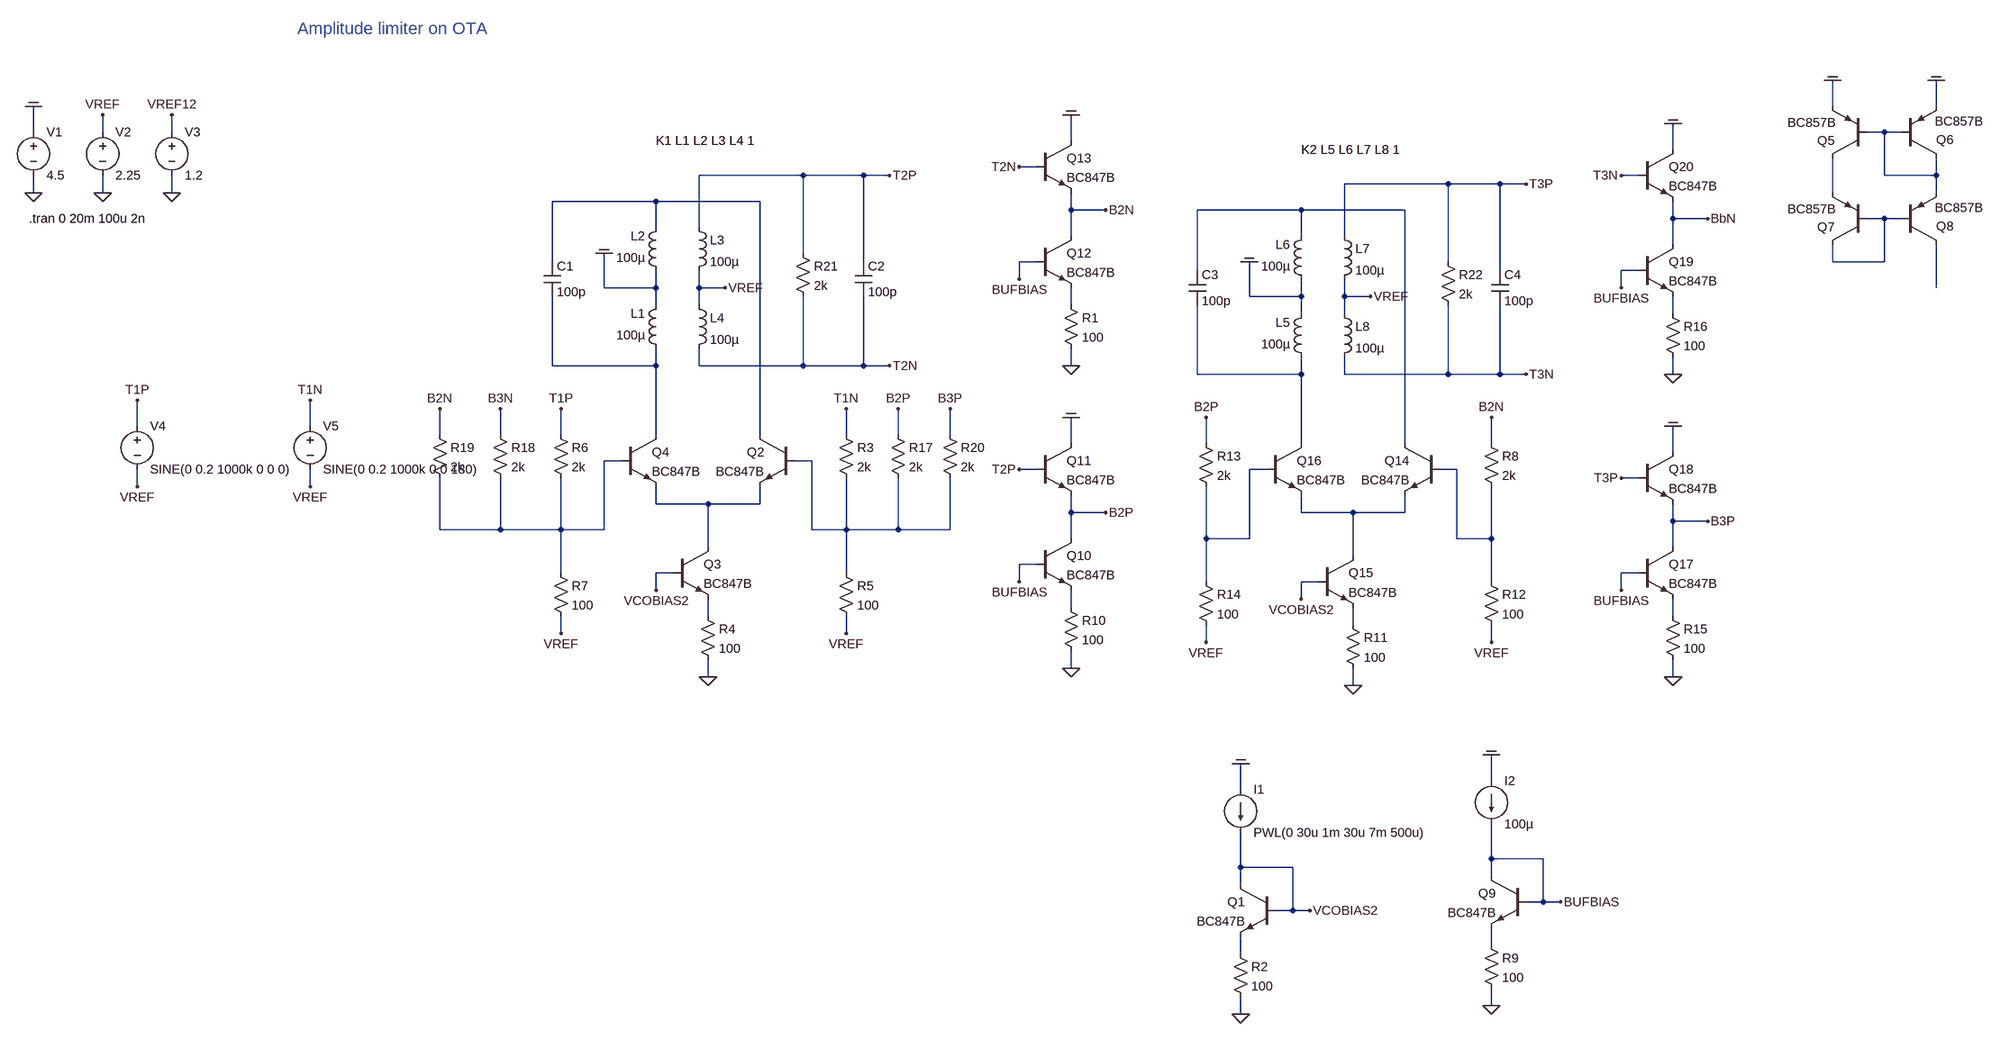
[diagram p0: schematic vco_bjt_v01.asc]
vco_bjt_v01.asc, the LTspice schematic file:
Version 4.1
SHEET 1 4092 1300
WIRE 3808 -464 3808 -512
WIRE 4000 -464 4000 -512
WIRE -1136 -416 -1136 -464
WIRE -1008 -416 -1008 -448
WIRE -880 -416 -880 -448
WIRE 3904 -416 3872 -416
WIRE 3936 -416 3904 -416
WIRE 784 -400 784 -448
WIRE 2016 -384 2016 -432
WIRE 720 -352 688 -352
WIRE 288 -336 96 -336
WIRE 400 -336 288 -336
WIRE 448 -336 400 -336
WIRE 1952 -336 1920 -336
WIRE 3904 -336 3904 -416
WIRE 4000 -336 4000 -368
WIRE 4000 -336 3904 -336
WIRE 1600 -320 1408 -320
WIRE 1696 -320 1600 -320
WIRE 1744 -320 1696 -320
WIRE -1136 -304 -1136 -336
WIRE -1008 -304 -1008 -336
WIRE -880 -304 -880 -336
WIRE 3808 -304 3808 -368
WIRE 4000 -304 4000 -336
WIRE 16 -288 -176 -288
WIRE 208 -288 16 -288
WIRE 784 -272 784 -304
WIRE 848 -272 784 -272
WIRE 1328 -272 1136 -272
WIRE 1520 -272 1328 -272
WIRE 2016 -256 2016 -288
WIRE 2080 -256 2016 -256
WIRE 3904 -256 3872 -256
WIRE 3936 -256 3904 -256
WIRE 16 -240 16 -288
WIRE 96 -240 96 -336
WIRE 784 -224 784 -272
WIRE 1328 -224 1328 -272
WIRE 1408 -224 1408 -320
WIRE 2016 -208 2016 -256
WIRE 288 -192 288 -336
WIRE -176 -176 -176 -288
WIRE 400 -176 400 -336
WIRE 720 -176 688 -176
WIRE 1600 -176 1600 -320
WIRE 3808 -176 3808 -208
WIRE 3904 -176 3904 -256
WIRE 3904 -176 3808 -176
WIRE 1136 -160 1136 -272
WIRE 1696 -160 1696 -320
WIRE 1952 -160 1920 -160
WIRE 688 -144 688 -176
WIRE -80 -128 -80 -192
WIRE 16 -128 16 -160
WIRE 16 -128 -80 -128
WIRE 96 -128 96 -160
WIRE 144 -128 96 -128
WIRE 1920 -128 1920 -160
WIRE 4000 -128 4000 -208
WIRE 1232 -112 1232 -176
WIRE 1328 -112 1328 -144
WIRE 1328 -112 1232 -112
WIRE 1408 -112 1408 -144
WIRE 1456 -112 1408 -112
WIRE 16 -96 16 -128
WIRE 96 -96 96 -128
WIRE 784 -96 784 -128
WIRE 1328 -80 1328 -112
WIRE 1408 -80 1408 -112
WIRE 2016 -80 2016 -112
WIRE -176 16 -176 -112
WIRE 16 16 16 -16
WIRE 16 16 -176 16
WIRE 96 16 96 -16
WIRE 288 16 288 -112
WIRE 288 16 96 16
WIRE 400 16 400 -112
WIRE 400 16 288 16
WIRE 448 16 400 16
WIRE 784 16 784 -16
WIRE 1136 32 1136 -96
WIRE 1328 32 1328 0
WIRE 1328 32 1136 32
WIRE 1408 32 1408 0
WIRE 1600 32 1600 -96
WIRE 1600 32 1408 32
WIRE 1696 32 1696 -96
WIRE 1696 32 1600 32
WIRE 1744 32 1696 32
WIRE 2016 32 2016 0
WIRE -944 128 -944 80
WIRE -624 128 -624 80
WIRE -384 144 -384 96
WIRE -272 144 -272 96
WIRE -160 144 -160 96
WIRE 16 144 16 16
WIRE 208 144 208 -288
WIRE 368 144 368 96
WIRE 464 144 464 96
WIRE 560 144 560 96
WIRE 784 160 784 112
WIRE 1152 160 1152 112
WIRE 1328 160 1328 32
WIRE 1520 160 1520 -272
WIRE 1680 160 1680 112
WIRE 2016 176 2016 128
WIRE -48 192 -80 192
WIRE 304 192 272 192
WIRE 720 208 688 208
WIRE 1264 208 1232 208
WIRE 1616 208 1584 208
WIRE 1952 224 1920 224
WIRE -944 240 -944 208
WIRE -624 240 -624 208
WIRE 16 272 16 240
WIRE 112 272 16 272
WIRE 208 272 208 240
WIRE 208 272 112 272
WIRE 784 288 784 256
WIRE 848 288 784 288
WIRE 1328 288 1328 256
WIRE 1424 288 1328 288
WIRE 1520 288 1520 256
WIRE 1520 288 1424 288
WIRE 2016 304 2016 272
WIRE 2080 304 2016 304
WIRE -384 320 -384 224
WIRE -272 320 -272 224
WIRE -272 320 -384 320
WIRE -160 320 -160 224
WIRE -160 320 -272 320
WIRE -80 320 -80 192
WIRE -80 320 -160 320
WIRE 304 320 304 192
WIRE 368 320 368 224
WIRE 368 320 304 320
WIRE 464 320 464 224
WIRE 464 320 368 320
WIRE 560 320 560 224
WIRE 560 320 464 320
WIRE 784 336 784 288
WIRE 1152 336 1152 240
WIRE 1232 336 1232 208
WIRE 1232 336 1152 336
WIRE 1616 336 1616 208
WIRE 1680 336 1680 240
WIRE 1680 336 1616 336
WIRE 112 352 112 272
WIRE 2016 352 2016 304
WIRE 1424 368 1424 288
WIRE 720 384 688 384
WIRE -160 400 -160 320
WIRE 48 400 16 400
WIRE 368 400 368 320
WIRE 1952 400 1920 400
WIRE 688 416 688 384
WIRE 1152 416 1152 336
WIRE 1360 416 1328 416
WIRE 1680 416 1680 336
WIRE 16 432 16 400
WIRE 1920 432 1920 400
WIRE 1328 448 1328 416
WIRE 784 464 784 432
WIRE 112 480 112 448
WIRE 2016 480 2016 448
WIRE 1424 496 1424 464
WIRE -160 512 -160 480
WIRE 368 512 368 480
WIRE 1152 528 1152 496
WIRE 1680 528 1680 496
WIRE 784 576 784 544
WIRE 112 592 112 560
WIRE 2016 592 2016 560
WIRE 1424 608 1424 576
WIRE 1680 848 1680 800
WIRE 1216 864 1216 816
WIRE 1680 992 1680 928
WIRE 1776 992 1680 992
WIRE 1216 1008 1216 944
WIRE 1312 1008 1216 1008
WIRE 1680 1024 1680 992
WIRE 1216 1040 1216 1008
WIRE 1776 1072 1776 992
WIRE 1776 1072 1744 1072
WIRE 1808 1072 1776 1072
WIRE 1312 1088 1312 1008
WIRE 1312 1088 1280 1088
WIRE 1344 1088 1312 1088
WIRE 1680 1152 1680 1120
WIRE 1216 1168 1216 1136
WIRE 1680 1264 1680 1232
WIRE 1216 1280 1216 1248
FLAG 1344 1088 VCOBIAS2
FLAG 1216 1280 0
FLAG 16 432 VCOBIAS2
FLAG 368 512 VREF
FLAG 112 592 0
FLAG 3808 -512 COM
FLAG 4000 -512 COM
FLAG -1136 -304 0
FLAG -1136 -464 COM
FLAG -1008 -304 0
FLAG -1008 -448 VREF
FLAG -880 -304 0
FLAG -880 -448 VREF12
FLAG -80 -192 COM
FLAG 144 -128 VREF
FLAG 368 96 T1N
FLAG -160 512 VREF
FLAG -160 96 T1P
FLAG -944 240 VREF
FLAG -944 80 T1P
FLAG -624 240 VREF
FLAG -624 80 T1N
FLAG 448 -336 T2P
FLAG 448 16 T2N
FLAG 1216 816 COM
FLAG 1808 1072 BUFBIAS
FLAG 1680 1264 0
FLAG 1680 800 COM
FLAG 688 416 BUFBIAS
FLAG 784 576 0
FLAG 784 112 COM
FLAG 688 208 T2P
FLAG 688 -144 BUFBIAS
FLAG 784 16 0
FLAG 784 -448 COM
FLAG 688 -352 T2N
FLAG 848 288 B2P
FLAG 848 -272 B2N
FLAG 1328 448 VCOBIAS2
FLAG 1680 528 VREF
FLAG 1424 608 0
FLAG 1232 -176 COM
FLAG 1456 -112 VREF
FLAG 1680 112 B2N
FLAG 1152 528 VREF
FLAG 1152 112 B2P
FLAG 1744 -320 T3P
FLAG 1744 32 T3N
FLAG 1920 432 BUFBIAS
FLAG 2016 592 0
FLAG 2016 128 COM
FLAG 1920 224 T3P
FLAG 1920 -128 BUFBIAS
FLAG 2016 32 0
FLAG 2016 -432 COM
FLAG 1920 -336 T3N
FLAG 2080 304 B3P
FLAG 2080 -256 BbN
FLAG 464 96 B2P
FLAG -272 96 B3N
FLAG -384 96 B2N
FLAG 560 96 B3P
SYMBOL npn 1280 1040 M0
SYMATTR InstName Q1
SYMATTR Value BC847B
SYMBOL Res 1200 1152 R0
SYMATTR InstName R2
SYMATTR Value 100
SYMBOL npn 272 144 M0
SYMATTR InstName Q2
SYMATTR Value BC847B
SYMBOL npn 48 352 R0
SYMATTR InstName Q3
SYMATTR Value BC847B
SYMBOL npn -48 144 R0
SYMATTR InstName Q4
SYMATTR Value BC847B
SYMBOL Res 352 128 R0
SYMATTR InstName R3
SYMATTR Value 2k
SYMBOL Res 96 464 R0
SYMATTR InstName R4
SYMATTR Value 100
SYMBOL Res 352 384 R0
SYMATTR InstName R5
SYMATTR Value 100
SYMBOL pnp 3872 -368 R180
WINDOW 0 60 32 Left 2
WINDOW 3 58 66 Left 2
SYMATTR InstName Q5
SYMATTR Value BC857B
SYMBOL pnp 3936 -368 M180
WINDOW 0 64 34 Left 2
WINDOW 3 61 68 Left 2
SYMATTR InstName Q6
SYMATTR Value BC857B
SYMBOL pnp 3872 -208 R180
WINDOW 0 60 32 Left 2
WINDOW 3 58 66 Left 2
SYMATTR InstName Q7
SYMATTR Value BC857B
SYMBOL pnp 3936 -208 M180
WINDOW 0 64 34 Left 2
WINDOW 3 61 68 Left 2
SYMATTR InstName Q8
SYMATTR Value BC857B
SYMBOL voltage -1136 -432 R0
SYMATTR InstName V1
SYMATTR Value 4.5
SYMBOL Voltage -1008 -432 R0
SYMATTR InstName V2
SYMATTR Value 2.25
SYMBOL Voltage -880 -432 R0
SYMATTR InstName V3
SYMATTR Value 1.2
SYMBOL ind 32 0 R180
WINDOW 0 36 80 Left 2
WINDOW 3 36 40 Left 2
SYMATTR InstName L1
SYMATTR Value 100µ
SYMATTR Type ind
SYMATTR SpiceLine Rser=10m Cpar=3p
SYMBOL ind 32 -144 R180
WINDOW 0 36 80 Left 2
WINDOW 3 36 40 Left 2
SYMATTR InstName L2
SYMATTR Value 100µ
SYMATTR Type ind
SYMATTR SpiceLine Rser=10m Cpar=3p
SYMBOL ind 80 -256 R0
SYMATTR InstName L3
SYMATTR Value 100µ
SYMATTR Type ind
SYMATTR SpiceLine Rser=10m Cpar=3p
SYMBOL ind 80 -112 R0
SYMATTR InstName L4
SYMATTR Value 100µ
SYMATTR Type ind
SYMATTR SpiceLine Rser=10m Cpar=3p
SYMBOL cap -192 -176 R0
SYMATTR InstName C1
SYMATTR Value 100p
SYMBOL cap 384 -176 R0
SYMATTR InstName C2
SYMATTR Value 100p
SYMBOL Res -176 128 R0
SYMATTR InstName R6
SYMATTR Value 2k
SYMBOL Res -176 384 R0
SYMATTR InstName R7
SYMATTR Value 100
SYMBOL voltage -944 112 R0
WINDOW 123 0 0 Left 0
WINDOW 39 0 0 Left 0
SYMATTR InstName V4
SYMATTR Value SINE(0 0.2 1000k 0 0 0)
SYMBOL voltage -624 112 R0
WINDOW 123 0 0 Left 0
WINDOW 39 0 0 Left 0
SYMATTR InstName V5
SYMATTR Value SINE(0 0.2 1000k 0 0 180)
SYMBOL current 1216 864 R0
WINDOW 123 0 0 Left 0
WINDOW 39 0 0 Left 0
SYMATTR InstName I1
SYMATTR Value PWL(0 30u 1m 30u 7m 500u)
SYMBOL npn 1744 1024 M0
SYMATTR InstName Q9
SYMATTR Value BC847B
SYMBOL Res 1664 1136 R0
SYMATTR InstName R9
SYMATTR Value 100
SYMBOL current 1680 848 R0
WINDOW 123 0 0 Left 0
WINDOW 39 0 0 Left 0
SYMATTR InstName I2
SYMATTR Value 100µ
SYMBOL npn 720 336 R0
SYMATTR InstName Q10
SYMATTR Value BC847B
SYMBOL Res 768 448 R0
SYMATTR InstName R10
SYMATTR Value 100
SYMBOL npn 720 160 R0
SYMATTR InstName Q11
SYMATTR Value BC847B
SYMBOL npn 720 -224 R0
SYMATTR InstName Q12
SYMATTR Value BC847B
SYMBOL Res 768 -112 R0
SYMATTR InstName R1
SYMATTR Value 100
SYMBOL npn 720 -400 R0
SYMATTR InstName Q13
SYMATTR Value BC847B
SYMBOL npn 1584 160 M0
SYMATTR InstName Q14
SYMATTR Value BC847B
SYMBOL npn 1360 368 R0
SYMATTR InstName Q15
SYMATTR Value BC847B
SYMBOL npn 1264 160 R0
SYMATTR InstName Q16
SYMATTR Value BC847B
SYMBOL Res 1664 144 R0
SYMATTR InstName R8
SYMATTR Value 2k
SYMBOL Res 1408 480 R0
SYMATTR InstName R11
SYMATTR Value 100
SYMBOL Res 1664 400 R0
SYMATTR InstName R12
SYMATTR Value 100
SYMBOL ind 1344 16 R180
WINDOW 0 36 80 Left 2
WINDOW 3 36 40 Left 2
SYMATTR InstName L5
SYMATTR Value 100µ
SYMATTR Type ind
SYMATTR SpiceLine Rser=10m Cpar=3p
SYMBOL ind 1344 -128 R180
WINDOW 0 36 80 Left 2
WINDOW 3 36 40 Left 2
SYMATTR InstName L6
SYMATTR Value 100µ
SYMATTR Type ind
SYMATTR SpiceLine Rser=10m Cpar=3p
SYMBOL ind 1392 -240 R0
SYMATTR InstName L7
SYMATTR Value 100µ
SYMATTR Type ind
SYMATTR SpiceLine Rser=10m Cpar=3p
SYMBOL ind 1392 -96 R0
SYMATTR InstName L8
SYMATTR Value 100µ
SYMATTR Type ind
SYMATTR SpiceLine Rser=10m Cpar=3p
SYMBOL cap 1120 -160 R0
SYMATTR InstName C3
SYMATTR Value 100p
SYMBOL cap 1680 -160 R0
SYMATTR InstName C4
SYMATTR Value 100p
SYMBOL Res 1136 144 R0
SYMATTR InstName R13
SYMATTR Value 2k
SYMBOL Res 1136 400 R0
SYMATTR InstName R14
SYMATTR Value 100
SYMBOL npn 1952 352 R0
SYMATTR InstName Q17
SYMATTR Value BC847B
SYMBOL Res 2000 464 R0
SYMATTR InstName R15
SYMATTR Value 100
SYMBOL npn 1952 176 R0
SYMATTR InstName Q18
SYMATTR Value BC847B
SYMBOL npn 1952 -208 R0
SYMATTR InstName Q19
SYMATTR Value BC847B
SYMBOL Res 2000 -96 R0
SYMATTR InstName R16
SYMATTR Value 100
SYMBOL npn 1952 -384 R0
SYMATTR InstName Q20
SYMATTR Value BC847B
SYMBOL Res 448 128 R0
SYMATTR InstName R17
SYMATTR Value 2k
SYMBOL Res -288 128 R0
SYMATTR InstName R18
SYMATTR Value 2k
SYMBOL Res -400 128 R0
SYMATTR InstName R19
SYMATTR Value 2k
SYMBOL Res 544 128 R0
SYMATTR InstName R20
SYMATTR Value 2k
SYMBOL Res 272 -208 R0
SYMATTR InstName R21
SYMATTR Value 2k
SYMBOL Res 1584 -192 R0
SYMATTR InstName R22
SYMATTR Value 2k
TEXT -648 -608 Left 3 ;Amplitude limiter on OTA
TEXT -1144 -256 Left 2 !.tran 0 20m 100u 2n
TEXT 16 -400 Left 2 !K1 L1 L2 L3 L4 1
TEXT 1328 -384 Left 2 !K2 L5 L6 L7 L8 1

The netlist it stands for:
* vco_bjt_v01.asc
Q1 VCOBIAS2 VCOBIAS2 N022 0 BC847B
R2 N022 0 100
Q2 N003 N012 N015 0 BC847B
Q3 N015 VCOBIAS2 N018 0 BC847B
Q4 N009 N011 N015 0 BC847B
R3 T1N N012 2k
R4 N018 0 100
R5 N012 VREF 100
Q5 N002 N001 COM 0 BC857B
Q6 N001 N001 COM 0 BC857B
Q7 N005 N005 N002 0 BC857B
Q8 N006 N005 N001 0 BC857B
V1 COM 0 4.5
V2 VREF 0 2.25
V3 VREF12 0 1.2
L1 N009 COM 100µ Rser=10m Cpar=3p
L2 COM N003 100µ Rser=10m Cpar=3p
L3 T2P VREF 100µ Rser=10m Cpar=3p
L4 VREF T2N 100µ Rser=10m Cpar=3p
C1 N003 N009 100p
C2 T2P T2N 100p
R6 T1P N011 2k
R7 N011 VREF 100
V4 T1P VREF SINE(0 0.2 1000k 0 0 0)
V5 T1N VREF SINE(0 0.2 1000k 0 0 180)
I1 COM VCOBIAS2 PWL(0 30u 1m 30u 7m 500u)
Q9 BUFBIAS BUFBIAS N021 0 BC847B
R9 N021 0 100
I2 COM BUFBIAS 100µ
Q10 B2P BUFBIAS N017 0 BC847B
R10 N017 0 100
Q11 COM T2P B2P 0 BC847B
Q12 B2N BUFBIAS N007 0 BC847B
R1 N007 0 100
Q13 COM T2N B2N 0 BC847B
Q14 N004 N014 N016 0 BC847B
Q15 N016 VCOBIAS2 N020 0 BC847B
Q16 N010 N013 N016 0 BC847B
R8 B2N N014 2k
R11 N020 0 100
R12 N014 VREF 100
L5 N010 COM 100µ Rser=10m Cpar=3p
L6 COM N004 100µ Rser=10m Cpar=3p
L7 T3P VREF 100µ Rser=10m Cpar=3p
L8 VREF T3N 100µ Rser=10m Cpar=3p
C3 N004 N010 100p
C4 T3P T3N 100p
R13 B2P N013 2k
R14 N013 VREF 100
Q17 B3P BUFBIAS N019 0 BC847B
R15 N019 0 100
Q18 COM T3P B3P 0 BC847B
Q19 BbN BUFBIAS N008 0 BC847B
R16 N008 0 100
Q20 COM T3N BbN 0 BC847B
R17 B2P N012 2k
R18 B3N N011 2k
R19 B2N N011 2k
R20 B3P N012 2k
R21 T2P T2N 2k
R22 T3P T3N 2k
.model NPN NPN
.model PNP PNP
.lib standard.bjt
* Amplitude limiter on OTA
.tran 0 20m 100u 2n
K1 L1 L2 L3 L4 1
K2 L5 L6 L7 L8 1
.backanno
.end